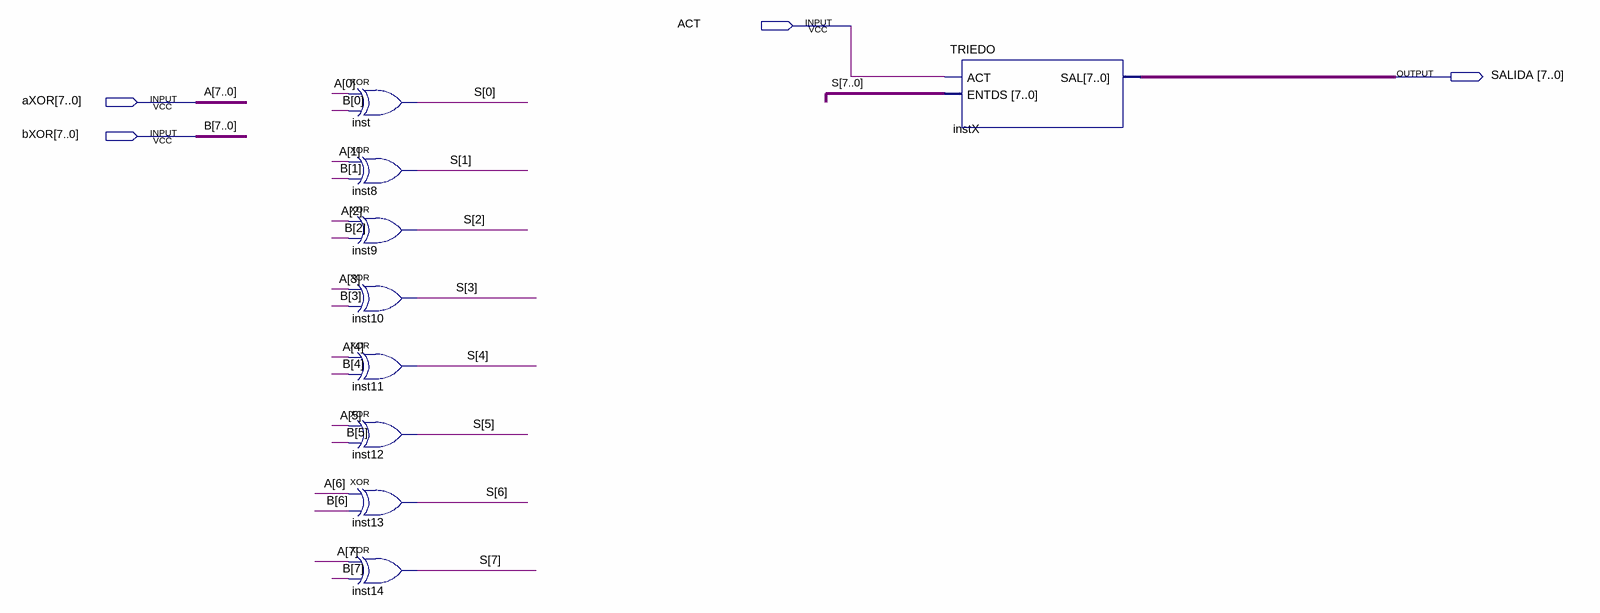
[diagram p0: schematic sheet]
// Quartus schematic F-XOR.bdf as structural Verilog: 9 symbols, 4 pins
module \F-XOR  (
  input  ACT,
  input  [7:0] aXOR,
  input  [7:0] bXOR,
  output [7:0] SALIDA
);

  wire [7:0] S;

  xor inst (S[0], aXOR[0], bXOR[0]);
  xor inst8 (S[1], aXOR[1], bXOR[1]);
  xor inst9 (S[2], aXOR[2], bXOR[2]);
  xor inst10 (S[3], aXOR[3], bXOR[3]);
  xor inst11 (S[4], aXOR[4], bXOR[4]);
  xor inst12 (S[5], aXOR[5], bXOR[5]);
  xor inst13 (S[6], aXOR[6], bXOR[6]);
  xor inst14 (S[7], aXOR[7], bXOR[7]);
  TRIEDO instX (.ACT(ACT), .ENTDS(S), .SAL(SALIDA));

  // Other names for the same wires on the sheet: A[7:0] = aXOR; B[7:0] = bXOR
endmodule
